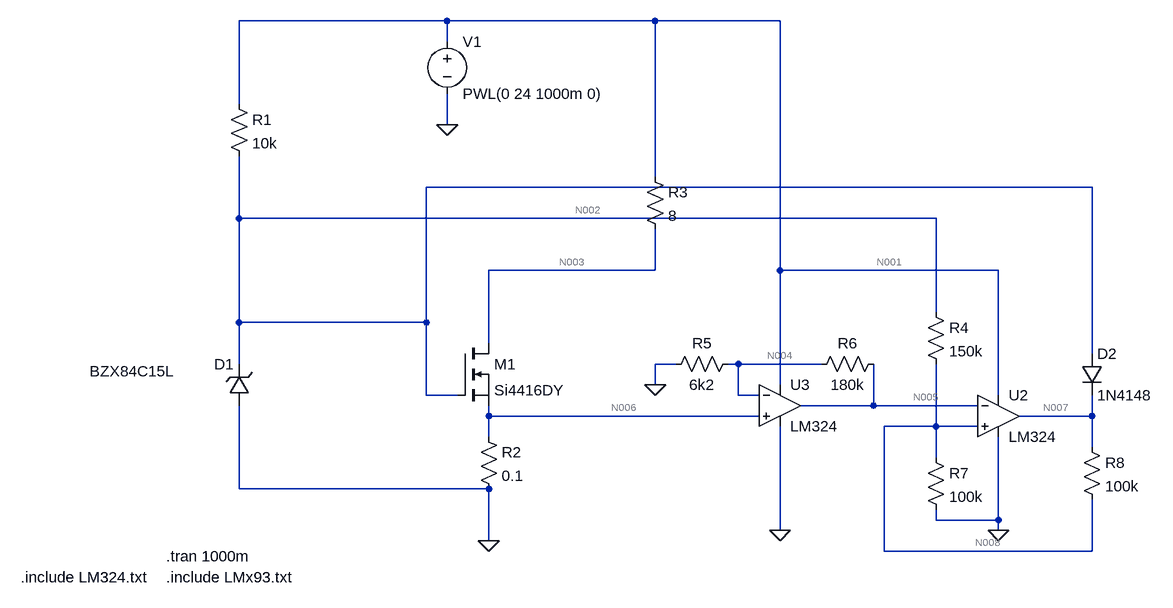
[diagram p0: schematic Rev1.1.asc]
Rev1.1.asc, the LTspice schematic file:
Version 4
SHEET 1 1468 680
WIRE 256 -400 -64 -400
WIRE 576 -400 256 -400
WIRE 768 -400 576 -400
WIRE 256 -368 256 -400
WIRE -64 -272 -64 -400
WIRE 256 -240 256 -288
WIRE 576 -160 576 -400
WIRE 1248 -144 224 -144
WIRE -64 -96 -64 -192
WIRE 1008 -96 -64 -96
WIRE 576 -16 576 -80
WIRE 576 -16 320 -16
WIRE 768 -16 768 -400
WIRE 1104 -16 768 -16
WIRE 1008 48 1008 -96
WIRE -64 64 -64 -96
WIRE 224 64 224 -144
WIRE 224 64 -64 64
WIRE 320 96 320 -16
WIRE 1248 112 1248 -144
WIRE -64 128 -64 64
WIRE 608 128 576 128
WIRE 704 128 688 128
WIRE 832 128 704 128
WIRE 576 160 576 128
WIRE 768 160 768 -16
WIRE 224 176 224 64
WIRE 272 176 224 176
WIRE 704 176 704 128
WIRE 736 176 704 176
WIRE 1104 176 1104 -16
WIRE 912 192 912 128
WIRE 912 192 800 192
WIRE 1072 192 912 192
WIRE 320 208 320 192
WIRE 736 208 320 208
WIRE 1248 208 1248 176
WIRE 1248 208 1136 208
WIRE 1008 224 1008 128
WIRE 1008 224 928 224
WIRE 1072 224 1008 224
WIRE 320 240 320 208
WIRE 1248 256 1248 208
WIRE 1008 272 1008 224
WIRE -64 320 -64 192
WIRE 320 320 -64 320
WIRE 1008 368 1008 352
WIRE 1104 368 1104 240
WIRE 1104 368 1008 368
WIRE 768 384 768 224
WIRE 1104 384 1104 368
WIRE 320 400 320 320
WIRE 928 416 928 224
WIRE 1248 416 1248 336
WIRE 1248 416 928 416
FLAG 320 400 0
FLAG 256 -240 0
FLAG 768 384 0
FLAG 576 160 0
FLAG 1104 384 0
SYMBOL zener -48 192 R180
WINDOW 0 24 64 Left 2
WINDOW 3 115 53 Left 2
SYMATTR InstName D1
SYMATTR Value BZX84C15L
SYMBOL nmos 272 96 R0
SYMATTR InstName M1
SYMATTR Value Si4416DY
SYMBOL res -80 -288 R0
SYMATTR InstName R1
SYMATTR Value 10k
SYMBOL res 560 -176 R0
SYMATTR InstName R3
SYMATTR Value 8
SYMBOL voltage 256 -384 R0
WINDOW 123 0 0 Left 2
WINDOW 39 0 0 Left 2
SYMATTR InstName V1
SYMATTR Value PWL(0 24 1000m 0)
SYMBOL res 304 224 R0
SYMATTR InstName R2
SYMATTR Value 0.1
SYMBOL Opamps\\opamp2 768 128 R0
SYMATTR InstName U3
SYMATTR Value LM324
SYMBOL res 704 112 R90
WINDOW 0 0 56 VBottom 2
WINDOW 3 32 56 VTop 2
SYMATTR InstName R5
SYMATTR Value 6k2
SYMBOL res 928 112 R90
WINDOW 0 0 56 VBottom 2
WINDOW 3 32 56 VTop 2
SYMATTR InstName R6
SYMATTR Value 180k
SYMBOL Opamps\\opamp2 1104 144 R0
SYMATTR InstName U2
SYMATTR Value LM324
SYMBOL res 992 32 R0
SYMATTR InstName R4
SYMATTR Value 150k
SYMBOL res 992 256 R0
SYMATTR InstName R7
SYMATTR Value 100k
SYMBOL diode 1232 112 R0
SYMATTR InstName D2
SYMATTR Value 1N4148
SYMBOL res 1232 240 R0
SYMATTR InstName R8
SYMATTR Value 100k
TEXT -176 424 Left 2 !.tran 1000m
TEXT -176 456 Left 2 !.include LMx93.txt
TEXT -400 456 Left 2 !.include LM324.txt

The netlist it stands for:
* Rev1.1.asc
D1 0 N002 BZX84C15L
M1 N003 N002 N006 N006 Si4416DY
R1 N001 N002 10k
R3 N001 N003 8
V1 N001 0 PWL(0 24 1000m 0)
R2 N006 0 0.1
XU3 N006 N004 N001 0 N005 LM324  ; pins In+ In- V+ V- OUT
R5 N004 0 6k2
R6 N005 N004 180k
XU2 N008 N005 N001 0 N007 LM324  ; pins In+ In- V+ V- OUT
R4 N002 N008 150k
R7 N008 0 100k
D2 N002 N007 1N4148
R8 N007 N008 100k
.model D D
.lib standard.dio
.model NMOS NMOS
.model PMOS PMOS
.lib standard.mos
.tran 1000m
.include LMx93.txt
.include LM324.txt
.backanno
.end

* Results of the author's LTspice run, read from the files saved beside the schematic
* Operating Point, zero values left out:
*   V(n002) = 14.98 V
*   V(n003) = 357.8 mV
*   V(n006) = 295.5 mV
*   V(n001) = 24 V
*   V(n005) = 8.891 V
*   V(n004) = 296.2 mV
*   V(n007) = 22.5 V
*   V(n008) = 12.18 V
*   Id(M1) = 2.955 A
*   Is(M1) = -2.955 A
*   I(D2) = -2.528 nA
*   I(D1) = -883.2 µA
*   I(R8) = 103.1 µA
*   I(R7) = 121.8 µA
*   I(R4) = 18.67 µA
*   I(R6) = 47.75 µA
*   I(R5) = 47.77 µA
*   I(R2) = 2.955 A
*   I(R3) = 2.955 A
*   I(R1) = 901.9 µA
*   I(V1) = -2.958 A
*   Ix(u3:1) = -21.28 nA
*   Ix(u3:2) = -20.95 nA
*   Ix(u3:3) = 801.9 µA
*   Ix(u3:4) = -802.4 µA
*   Ix(u3:5) = -47.71 µA
*   Ix(u2:1) = 14.84 pA
*   Ix(u2:2) = -40.49 nA
*   Ix(u2:3) = 793.8 µA
*   Ix(u2:4) = -801.9 µA
*   Ix(u2:5) = -103.1 µA